# Altium project Strain_gauge_Interface.PrjPcb
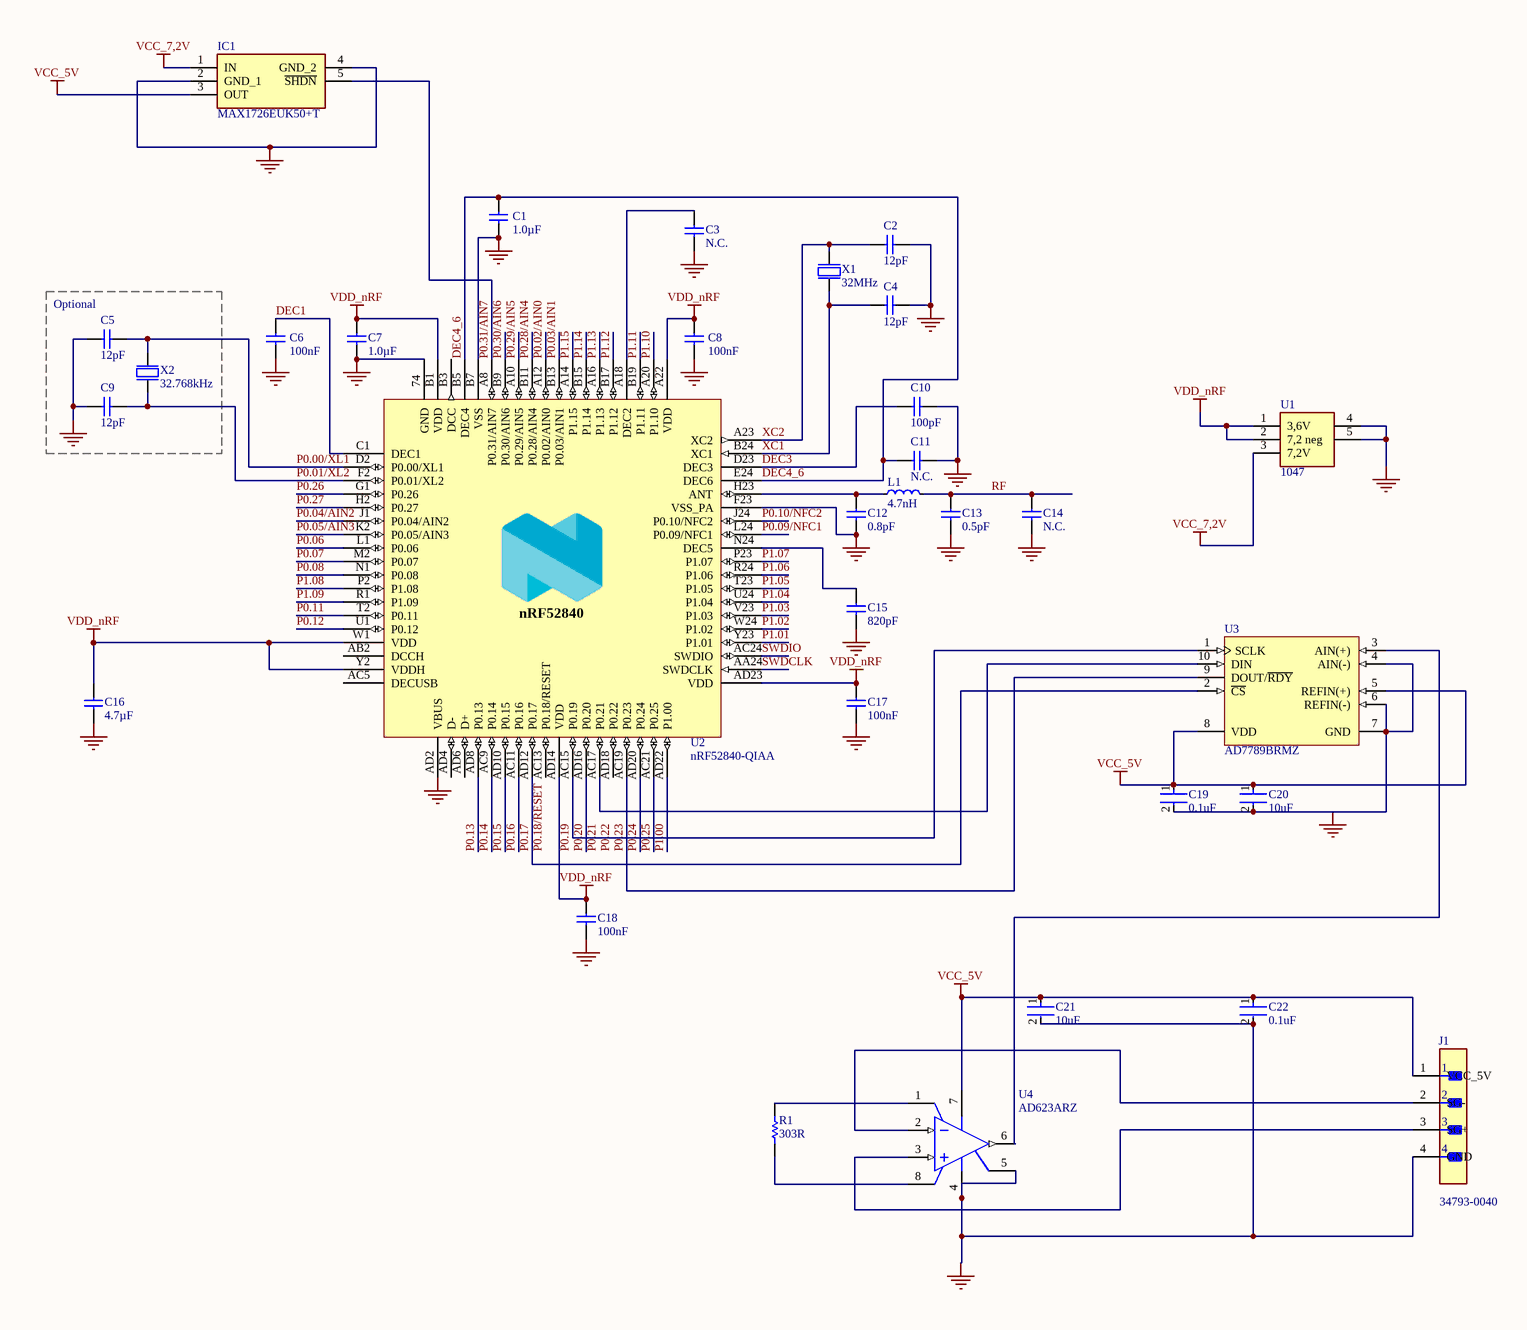
[diagram p0: Sheet1.SchDoc]
1 sheet, 32 parts. Net scope: global (net labels, ports and power ports of the same name join across sheets).
Board file: PCB1.PcbDoc

## Sheet Sheet1.SchDoc
size A2; SheetNumber: 1; SheetTotal: 1

### Parts
C1  1.0µF  [CAPC1608X06L]
C2  12pF  [CAPC1005X04L]
C3  N.C.  [CAPC1005X04L]
C4  12pF  [CAPC1005X04L]
C5  12pF  [CAPC1005X04L]
C6  100nF  [CAPC1005X04L]
C7  1.0µF  [CAPC1608X06L]
C8  100nF  [CAPC1005X04L]
C9  12pF  [CAPC1005X04L]
C10  100pF  [CAPC1005X04L]
C11  N.C.  [CAPC1005X04L]
C12  0.8pF  [CAPC1005X04L]
C13  0.5pF  [CAPC1005X04L]
C14  N.C.  [CAPC1005X04L]
C15  820pF  [CAPC1005X04L]
C16  4.7µF  [CAPC1608X06L]
C17  100nF  [CAPC1005X04L]
C18  100nF  [CAPC1005X04L]
C19  0.1uF  [FP-C1206C-EB-MFG]
C20  10uF  [FP-GRM188-0_1-e0_2_0_55-IPC_A]
C21  10uF  [FP-GRM188-0_1-e0_2_0_55-IPC_A]
C22  0.1uF  [FP-C1206C-EB-MFG]
IC1  MAX1726EUK50+T  [SOT95P280X145-5N]
J1  34793-0040  [FP-34793-0040-MFG]
L1  4.7nH  [INDC1005X04L]
R1  303R  [RESC2013X70X40LL20T20]
U1  1047  [1047]
U2  nRF52840-QIAA  [AQFN50P700X700X85_HS-74N]
U3  AD7789BRMZ  [RM-10_M]
U4  AD623ARZ  [ADI-AD623ARZ-8_M]
X1  32MHz  [BT-XTAL_2016]
X2  32.768kHz  [XTAL_3215]

### Blocks framed on the sheet
Optional: C5 C9 X2

### Nets
GND: C1.1 C2.2 C3.2 C4.2 C5.2 C6.2 C7.2 C8.2 C9.2 C10.2 C11.1 C12.1 C13.1 C14.2 C15.2 C16.2 C17.2 C18.2 C21.2 C22.2 IC1.2(GND_1) IC1.4(GND_2) J1.4(GND) U1.4(Gnd) U1.5(Gnd) U2.74(GND) U2.AD2(VBUS) U2.B7(VSS) U2.F23(VSS_PA) U4.4(-VS) U4.5(REF) X1.2(GND) X1.4(GND)
VCC_5V: C19.1 C20.1 C21.1 C22.1 IC1.3(OUT) J1.1(VCC_5V) U3.5(REFIN(+)) U3.8(VDD) U4.7(+VS)
VCC_7,2V: IC1.1(IN) U1.3(7,2V)
VDD_nRF: C7.1 C8.1 C16.1 C17.1 C18.1 U1.1(3,6V) U1.2(7,2_neg) U2.A22(VDD) U2.AD14(VDD) U2.AD23(VDD) U2.B1(VDD) U2.W1(VDD) U2.Y2(VDDH)
DEC1: C6.1 U2.C1(DEC1)
DEC3: C10.1 U2.D23(DEC3)
DEC4_6: C1.2 C11.2 U2.B5(DEC4) U2.E24(DEC6)
P0.00/XL1: C5.1 U2.D2(P0.00/XL1) X2.1(inp)
P0.01/XL2: C9.1 U2.F2(P0.01/XL2) X2.2(out)
P0.02/AIN0: U2.A12(P0.02/AIN0)
P0.03/AIN1: U2.B13(P0.03/AIN1)
P0.04/AIN2: U2.J1(P0.04/AIN2)
P0.05/AIN3: U2.K2(P0.05/AIN3)
P0.06: U2.L1(P0.06)
P0.07: U2.M2(P0.07)
P0.08: U2.N1(P0.08)
P0.09/NFC1: U2.L24(P0.09/NFC1)
P0.10/NFC2: U2.J24(P0.10/NFC2)
P0.11: U2.T2(P0.11)
P0.12: U2.U1(P0.12)
P0.13: U2.AD8(P0.13)
P0.14: U2.AC9(P0.14)
P0.15: U2.AD10(P0.15)
P0.16: U2.AC11(P0.16)
P0.17: U2.AD12(P0.17) U3.2(~{CS})
P0.20: U2.AD16(P0.20)
P0.23: U2.AC19(P0.23) U3.9(DOUT/~{RDY})
P0.24: U2.AD20(P0.24)
P0.25: U2.AC21(P0.25)
P0.26: U2.G1(P0.26)
P0.27: U2.H2(P0.27)
P0.28/AIN4: U2.B11(P0.28/AIN4)
P0.29/AIN5: U2.A10(P0.29/AIN5)
P0.30/AIN6: U2.B9(P0.30/AIN6)
P0.31/AIN7: IC1.5(~{SHDN}) U2.A8(P0.31/AIN7)
P1.00: U2.AD22(P1.00)
P1.01: U2.Y23(P1.01)
P1.02: U2.W24(P1.02)
P1.03: U2.V23(P1.03)
P1.04: U2.U24(P1.04)
P1.05: U2.T23(P1.05)
P1.06: U2.R24(P1.06)
P1.07: U2.P23(P1.07)
P1.08: U2.P2(P1.08)
P1.09: U2.R1(P1.09)
P1.10: U2.A20(P1.10)
P1.11: U2.B19(P1.11)
P1.12: U2.B17(P1.12)
P1.13: U2.A16(P1.13)
P1.14: U2.B15(P1.14)
P1.15: U2.A14(P1.15)
RF: C13.2 C14.1 L1.2
SWDCLK: U2.AA24(SWDCLK)
SWDIO: U2.AC24(SWDIO)
XC1: C4.1 U2.B24(XC1) X1.1(inp)
XC2: C2.1 U2.A23(XC2) X1.3(out)
NetC3_1: C3.1 U2.A18(DEC2)
NetC12_2: C12.2 L1.1 U2.H23(ANT)
NetC15_1: C15.1 U2.N24(DEC5)
NetC19_2: C19.2 C20.2 U3.4(AIN(-)) U3.6(REFIN(-)) U3.7(GND)
NetJ1_2: J1.2(SG-) U4.2(-IN)
NetJ1_3: J1.3(SG+) U4.3(+IN)
NetR1_1: R1.1 U4.1(-RG)
NetR1_2: R1.2 U4.8(+RG)
NetU2_AC15: U2.AC15(P0.19) U3.1(SCLK)
NetU2_AC17: U2.AC17(P0.21) U3.10(DIN)
NetU3_3: U3.3(AIN(+)) U4.6(OUTPUT)

Not connected (* = marked no-connect by the designer): U2 AB2(DCCH) AC5(DECUSB) AC13(P0.18/RESET) AD4(D-) AD6(D+) AD18(P0.22) B3(DCC)

### Notes on the sheet
- Labels drawn without touching a wire or pin: GND, P0.18/RESET, P0.19, P0.21, P0.22
- (in symbol nRF52840-QIAAD0) nRF52840

### Library data of the parts
C1 C7 = C0603-1µ0: Capacitor, X7R, ±10%; Note: 16V; Part Number: C0603-1µ0; LatestRevisionDate: 2013-06-05; Pin Count: 2; Publisher: Nordic Semiconductor; Published: 2009-05-08; Value: 1.0µF; Footprint Doc: 0603
C2 C4 C5 C9 = C0402-12p: Capacitor, NP0, ±2%; Note: 50V; Part Number: C0402-12p; LatestRevisionDate: 2011-05-11; Pin Count: 2; Publisher: Nordic Semiconductor; Published: 2009-05-08; Value: 12pF; Footprint Doc: 0402
C3 C11 = C0402-N.C.: Not mounted; Assembly: Not mounted; Part Number: C0402-N.C.; LatestRevisionDate: 2009-05-08; Pin Count: 2; Publisher: Nordic Semiconductor; Published: 2009-05-08; Value: N.C.; Footprint Doc: 0402
C6 C8 C17 C18 = C0402-100n: Capacitor, X7R, ±10%; Note: 16V; Part Number: C0402-100n; LatestRevisionDate: 2009-11-23; Pin Count: 2; Publisher: Nordic Semiconductor; Published: 2009-05-08; Value: 100nF; Footprint Doc: 0402
C10 = C0402-100p: Capacitor, NP0, ±5%; Note: 50V; Part Number: C0402-100p; LatestRevisionDate: 2009-05-08; Pin Count: 2; Publisher: Nordic Semiconductor; Published: 2009-05-08; Value: 100pF; Footprint Doc: 0402
C12 = C0402-0.8p: Capacitor, NP0, ±10%; Note: 50V; Part Number: C0402-0.8p; LatestRevisionDate: 2012-11-21; Pin Count: 2; Publisher: Nordic Semiconductor; Published: 2009-05-08; Value: 0.8pF; Footprint Doc: 0402
C13 = C0402-0.5p: Capacitor, NP0, ±10%; Note: 50V; Part Number: C0402-0.5p; LatestRevisionDate: 2017-02-23; Pin Count: 2; Publisher: Nordic Semiconductor; Published: 2009-05-08; Value: 0.5pF; Footprint Doc: 0402
C14 = C0402-N.C.: Not mounted; Note: Chip Cap; Assembly: Not mounted; Part Number: C0402-N.C.; LatestRevisionDate: 2009-05-08; Pin Count: 2; Publisher: Nordic Semiconductor; Published: 2009-05-08; Value: N.C.; Footprint Doc: 0402
C15 = C0402-820p: Capacitor, NP0, ±5%; Note: 50V; Part Number: C0402-820p; LatestRevisionDate: 2009-05-08; Pin Count: 2; Publisher: Nordic Semiconductor; Published: 2009-05-08; Value: 820pF; Footprint Doc: 0402
C16 = C0603-4µ7-6.3V-X7R: Capacitor, X7R, ±10%; Note: 6.3V; Part Number: C0603-4µ7-6.3V-X7R; LatestRevisionDate: 2015-06-10; Pin Count: 2; Publisher: Nordic Semiconductor; Published: 2015-06-10; Value: 4.7µF; Footprint Doc: 0603
C19 C22 = CMP-03020-000153-1: CAP CER 0.1UF 100V X7R 1206; Manufacturer: KEMET; Manufacturer Part Number: C1206C104K1RACTU; Value: 0.10 μF; Tolerance: 0.1; Material: Ceramic; Temperature Coefficient: 15%; Automotive Grade: Grade 0; Voltage Rating: 100 V; Automotive: Yes; Ipc Land Pattern Name: CAPC320160X78; Device Class L1: Passive Components; ComponentLink2Description: Datasheet; Temperature Range Low: -55°C; Category: Cap; Octopart: https://octopart.com/c1206c104k1ractu-kemet-89521; Height: 0.88mm; Lead Free: Yes; Digikey Description: CAP CER 0.1UF 100V X7R 1206; Mouser Description: CAP CER 0.1UF 100V X7R 1206; Device Class L3: Ceramic Capacitors; Device Class L2: Capacitors; ComponentLink2URL: https://content.kemet.com/datasheets/KEM_C1007_X8R_ULTRA_150C_SMD.pdf; Temperature Range High: +150°C; Temperature Characteristic: X7R; RoHS: TRUE; Capacitance: 0.10 μF; Package: C1206C-EB; Temperature: -55°C to +150°C
C20 C21 = CMP-2006-02792-2: Chip Multilayer Ceramic Capacitors for General Purpose, 0603, 10uF, X5R, 15%, 20%, 6.3V; Packaging: Tape and Reel; Voltage Rating (DC): 6.3V; Width: 0.031inch; Termination: SMD/SMT; Dielectric: X5R; Package Quantity: 4000; Voltage Rating: 6.3V; Capacitance: 10uF; Case/Package: 0603; Min Operating Temperature: -55°C; Voltage: 6.3V; Length: 1.6mm; Thickness: 0.035inch; Lead Free: Lead Free; Depth: 0.8mm; Case Code (Imperial): 0603; Max Operating Temperature: 85°C; Material: Ceramic; Height: 0.8mm; Tolerance: 20%; Mount: Surface Mount; REACH SVHC: No SVHC; Radiation Hardening: No; Case Code (Metric): 1608
IC1 = MAX1726EUK50+T: Integrated Circuit; Manufacturer_Name: Maxim Integrated; Datasheet Link: http://componentsearchengine.com/Datasheets/1/MAX1726EUK50+T.pdf; Height: 1.45mm; Manufacturer_Part_Number: MAX1726EUK50+T; Mouser Part Number: 700-MAX1726EUK50T; Mouser Price/Stock: https://www.mouser.co.uk/ProductDetail/Maxim-Integrated/MAX1726EUK50%2bT?qs=Jw2w9zrI6w%252Bbrdx6zz2S%2FQ%3D%3D
J1 = CMP-04776-000092-1: CONN HEADER R/A 4POS 2MM; Manufacturer: Molex; Conn Orientation: Right Angle; Conn Gender: Male; Standoff Height: 0.32mm; Voltage Rating: 500V; Current Rating: 4A; Number Of Contacts: 4; Device Class L2: Headers and Wire Housings; Number Of Rows: 1; Device Class L3: unset; Device Class L1: Connectors; Manufacturer Part Number: 34793-0040; Category: Conn; Octopart: https://octopart.com/34793-0040-molex-22881898; ComponentLink2URL: http://www.molex.com/webdocs/datasheets/pdf/en-us/0347930040_PCB_HEADERS.pdf; Temperature Range Low: -40°C; Package: 34793-0040; RoHS: TRUE; Mouser Description: Mini50™ Unsealed, Single Row, Right-Angle Header, 4 Circuit, Polarization Option A, Black, Tray; Temperature Range High: +105°C; Pitch: 2mm; Digikey Description: CONN HEADER R/A 4POS 2MM; Lead Free: Yes; Footprint Url: https://www.molex.com/pdm_docs/sd/347930040_sd.pdf; Contact Material: Tin,Nickel; Temperature: -40°C to +105°C; Height: 10.02mm; ComponentLink2Description: Datasheet; Automotive: No
L1 = L0402-4n7: High frequency chip inductor ±5%; Part Number: L0402-4n7; LatestRevisionDate: 2012-09-19; Pin Count: 2; Publisher: Nordic Semiconductor; Published: 2009-05-08; Value: 4.7nH; Note: High frequency chip inductor ±5%; Footprint Doc: 0402
R1 = CMP-2001-00412-1: Manufacturer: Panasonic; Part Number: ERJ-6GEYJ3R0V
U1 = 1047: Undefined or Miscellaneous; Manufacturer_Name: Keystone Electronics; Datasheet Link: https://www.keyelco.com/product.cfm/product_id/14061; Height: 14.85mm; Manufacturer_Part_Number: 1047; Mouser Part Number: 534-1047; Mouser Price/Stock: https://www.mouser.co.uk/ProductDetail/Keystone-Electronics/1047?qs=up89fPMRNqBQruBm7zqCRQ%3D%3D
U2 = nRF52840-QIAAD0: Multi-protocol Bluetooth Low Energy, IEEE 802.15.4, ANT and 2.4GHz proprietary system-on-chip; Manufacturer: Nordic Semiconductor; Part Number: nRF52840-QIAAD0; LatestRevisionDate: 2018-12-04; Pin Count: 73; Publisher: Nordic Semiconductor; Published: 2018-12-04; Value: nRF52840-QIAA; Note: *; Footprint Doc: AQFN-73; Manufacturer Part Number: nRF52840-QIAAD0
U3 = CMP-0313-02267-2: Single 24-Bit Low Power Sigma-Delta Analog-to-Digital Converter with Serial, SPI Interface, 16.6SPS, -40 to +105 degC, RM-10, Pb-Free, Tube; Generic Part Number: AD7789; Manufacturer: Analog Devices; Manufacturer Part Number: 46999-0353; Channels: 1; Interface: Ser, SPI; Throughput Rate (SPS): 16.6; Resolution (Bits): 24; Gender: Male; Number of Contacts: 4; Pitch: 3.68mm; Glow Wire Compliant: Compliant; ComponentLink1Description: Manufacturer URL; ComponentLink3Description: Package Specification; RoHS: Y; ComponentLink4URL: http://www.analog.com/en/analog-to-digital-converters/ad-converters/ad7789/products/product.html; PartNumber: AD7789BRMZ; ComponentLink1URL: http://www.analog.com/en/index.html; ComponentLink2URL: http://www.analog.com/static/imported-files/data_sheets/AD7788_7789.pdf; PackageDescription: 10-Lead Mini Small Outline Package [MSOP]; PackageReference: RM-10; ComponentLink4Description: Product URL; DatasheetVersion: Rev.B; Mounting Technology: Surface Mount; ComponentLink2Description: Datasheet; PackageVersion: May-2005; ComponentLink3URL: http://www.analog.com/static/imported-files/packages/PKG_PDF/MSOP%28RM%29/RM_10.pdf; Packing: Tube; Supplier 1: Digi-Key; Category: Connectors; Stock 1: 6500; Pricing 1: 1=0,85000, 10=0,70300, 100=0,58600, 1000=0,46880, 2500=0,42485 (USD); Mount: Cable; Housing Material: Nylon; Housing Color: Natural; Min Operating Temperature: -40°C; Max Operating Temperature: 105°C; Orientation: Straight; Length: 18.6mm; REACH SVHC: No SVHC; ComponentLink5URL: https://datasheet.ciiva.com/30086/050291758-sd-30086280.pdf?src-supplier=Onlinecomponents.com; ComponentLink5Description: https://datasheet.ciiva.com/30086/050291758-sd-30086280.pdf?src-supplier=Onlinecomponents.com
U4 = CMP-2000-05040-1: Single-Supply, Rail-to-Rail, Low Cost Instrumentation Amplifier, 800 KHz, -40 to 85 degC, 8-Pin SOIC, RoHS, Tube; Manufacturer: Analog Devices; EDA / CAD Models: DownloadfromAcceleratedDesigns; PCN Design/Specification: AD623PolymideThickness02/Oct/2013AD623PolymideThickness15/Oct/2013; -3db Bandwidth: 800kHz; Voltage - Supply, Single/Dual (±): 2.7V~12V,±2.5V~6V; Current - Input Bias: 17nA; Voltage - Input Offset: 25µV; Slew Rate: 0.3V/µs; Current - Supply: 375µA; Mfg Application Notes: Electrocardiogram(ECG)Solutions; Number of Circuits: 1; Product Training Modules: InstrumentationAmplifiersPerformanceCommonPhotodiodeOp-AmpCircuitProblemsandSolutionsIndirectCurrentFeedbackInstrumentationAmplifierApplicationsGuide; Manufacturer URL: http://www.analog.com/; Packaging: Tube; Mounting Type: SurfaceMount; Output Type: Rail-to-Rail; Gain Bandwidth Product: -; Datasheet URL: https://datasheet.ciiva.com/20167/82-1224-20167284.pdf; Current - Output / Channel: -; Standard Package: 98; Supplier Device Package: 8-SOIC; Amplifier Type: Instrumentation; Datasheet Version: Rev. D, 07/2008; Family: Linear-Amplifiers-Instrumentation,OPAmps,BufferAmps; Online Catalog: Instrumentation; Operating Temperature: -40degC~85degC; Category: IntegratedCircuits(ICs); Package / Case: 8-SOIC(0.154",3.90mmWidth); Series: -
X1 = XTAL_SMD2016_32MHz_8pF_General: XTAL SMD 2016, 32MHz, Cl=8pF, Total Tol: ±40ppm; Part Number: XTAL_SMD2016_32MHz_8pF_General; LatestRevisionDate: 2016-08-19; Pin Count: 4; Publisher: Nordic Semiconductor; Published: 2016-08-19; Value: 32MHz; Footprint Doc: XTAL_2016
X2 = XTAL_SMD3215_32.768kHz_9pF_General: XTAL SMD 3215, 32.768kHz, Cl=9pF, Total Tol: ±50ppm; Part Number: XTAL_SMD3215_32.768kHz_9pF_General; LatestRevisionDate: 2016-08-19; Pin Count: 2; Publisher: Nordic Semiconductor; Published: 2016-08-19; Value: 32.768kHz; Footprint Doc: XTAL_3215